# EAGLE schematic RMP - HALF BRIDGE 0.0.1 (EAGLE 9.6.2)

## Sheet 1 of 5
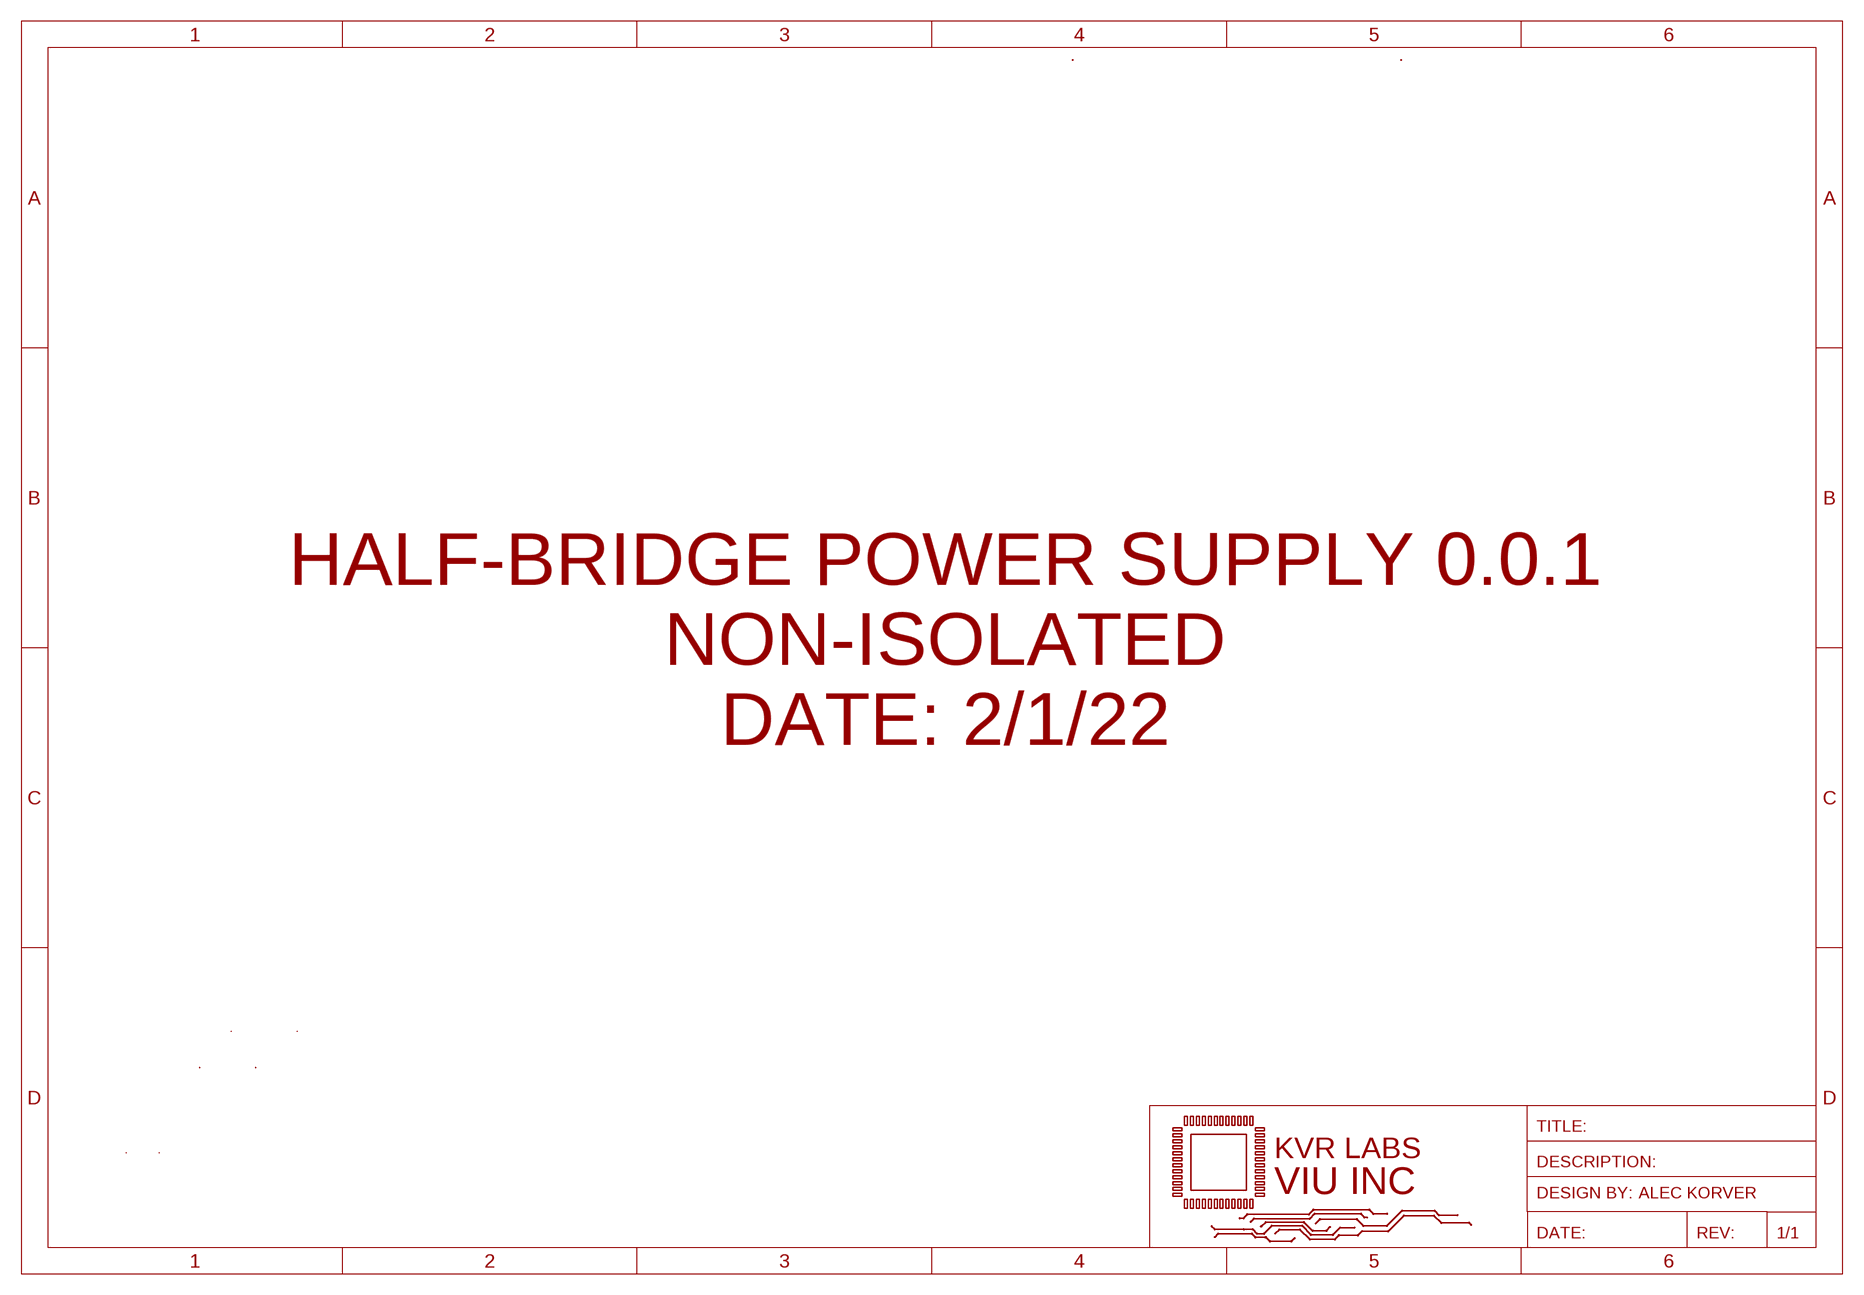
[diagram p0: schematic, sheet 1]

### Notes on the sheet
- HALF-BRIDGE POWER SUPPLY 0.0.1
  NON-ISOLATED
  DATE: 2/1/22

## Sheet 2 of 5: GATE DRIVERS
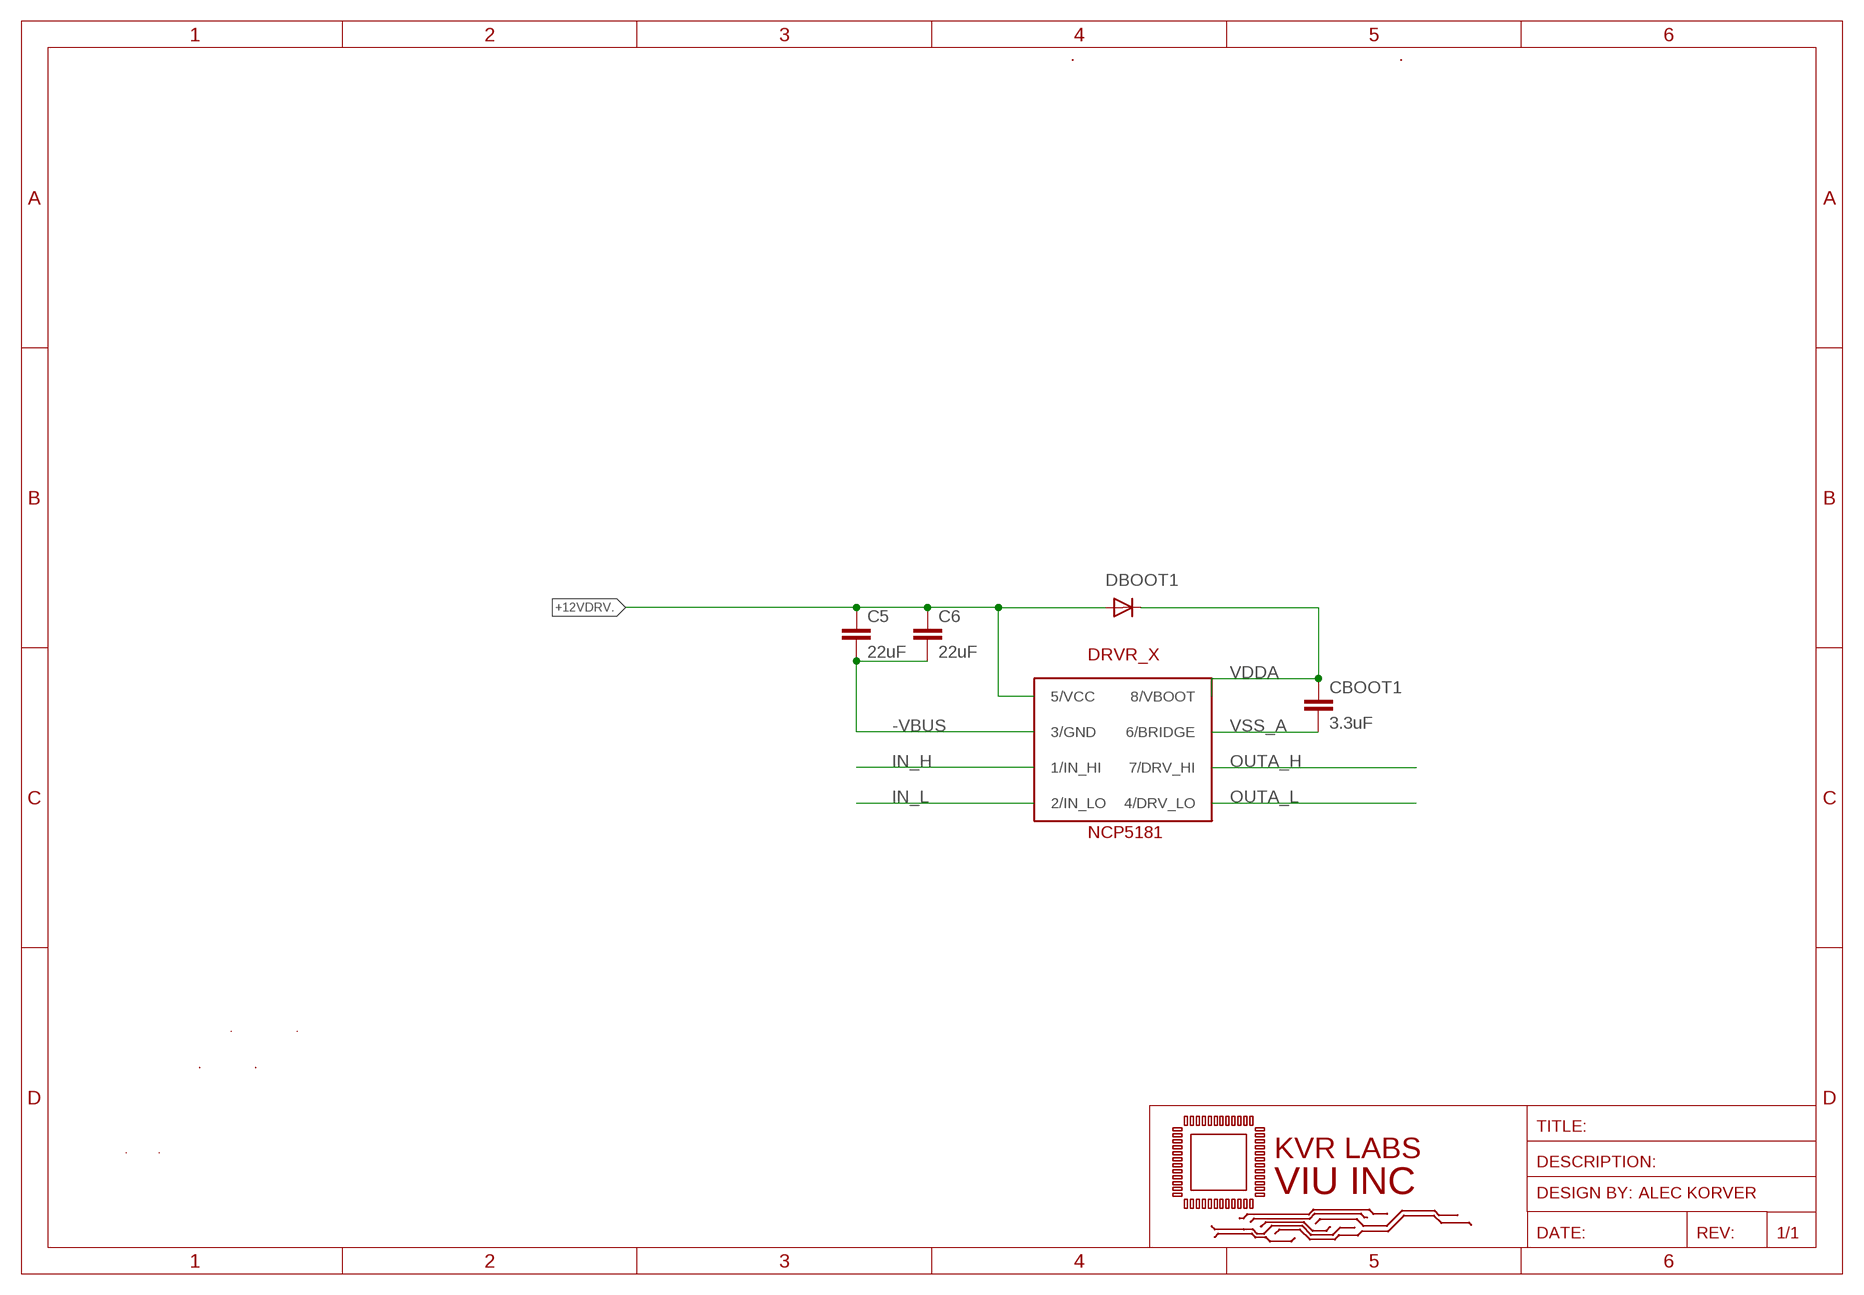
[diagram p1: schematic, sheet 2]

### Parts
C5  22uF  C-EUC1206  [C1206]
C6  22uF  C-EUC1206  [C1206]
CBOOT1  3.3uF  C-EUC1812  [C1812]
DBOOT1  DIODESMA  [SMADIODE]
DRVR_X  NCP5181  [8-SOIC]

### Nets
+12VDRV: C5.1 C6.1 DBOOT1.A DRVR_X.5(5/VCC) ; also sheet 4
-VBUS: C5.2 C6.2 DRVR_X.3(3/GND) ; also sheet 3,4,5
IN_H: DRVR_X.1(1/IN_HI) ; also sheet 4
IN_L: DRVR_X.2(2/IN_LO) ; also sheet 4
OUTA_H: DRVR_X.7(7/DRV_HI) ; also sheet 3
OUTA_L: DRVR_X.4(4/DRV_LO) ; also sheet 3
VDDA: CBOOT1.1 DBOOT1.C DRVR_X.8(8/VBOOT) ; also sheet 3,4,5
VSS_A: CBOOT1.2 DRVR_X.6(6/BRIDGE) ; also sheet 3,4

## Sheet 3 of 5: H BRIDGE - AC/DC STAGE
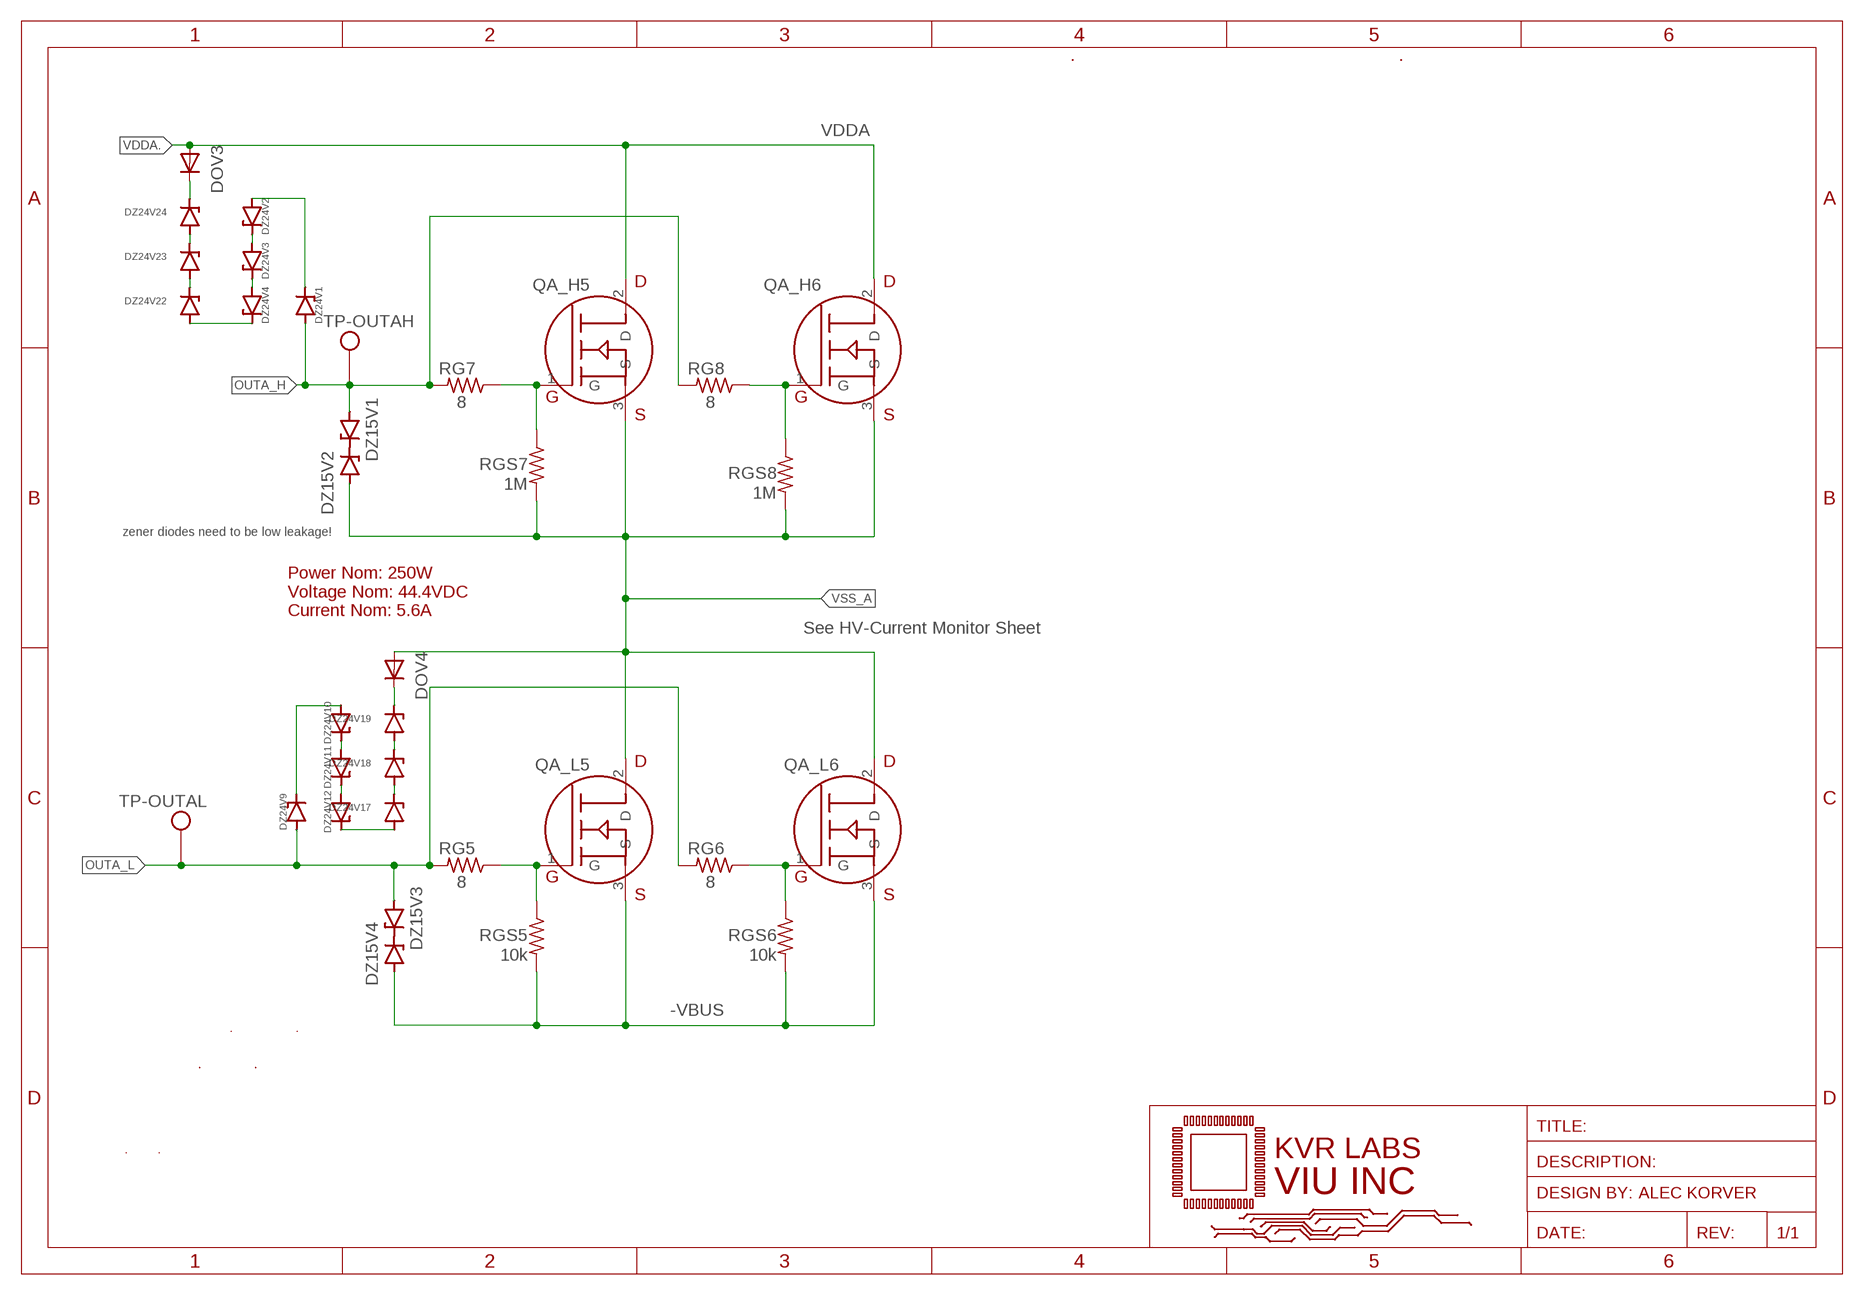
[diagram p2: schematic, sheet 3]

### Parts
DOV3  DIODESMA  [SMADIODE]
DOV4  DIODESMA  [SMADIODE]
DZ15V1  NZH15B,115  ZENER_MMSZ5240BTDO-219-AB(SOD123F)  [SODFL3718X115]
DZ15V2  NZH15B,115  ZENER_MMSZ5240BTDO-219-AB(SOD123F)  [SODFL3718X115]
DZ15V3  NZH15B,115  ZENER_MMSZ5240BTDO-219-AB(SOD123F)  [SODFL3718X115]
DZ15V4  NZH15B,115  ZENER_MMSZ5240BTDO-219-AB(SOD123F)  [SODFL3718X115]
DZ24V1  NZH15B,115  ZENER_MMSZ5240BTDO-219-AB(SOD123F)  [SODFL3718X115]
DZ24V2  NZH15B,115  ZENER_MMSZ5240BTDO-219-AB(SOD123F)  [SODFL3718X115]
DZ24V3  NZH15B,115  ZENER_MMSZ5240BTDO-219-AB(SOD123F)  [SODFL3718X115]
DZ24V4  NZH15B,115  ZENER_MMSZ5240BTDO-219-AB(SOD123F)  [SODFL3718X115]
DZ24V9  NZH15B,115  ZENER_MMSZ5240BTDO-219-AB(SOD123F)  [SODFL3718X115]
DZ24V10  NZH15B,115  ZENER_MMSZ5240BTDO-219-AB(SOD123F)  [SODFL3718X115]
DZ24V11  NZH15B,115  ZENER_MMSZ5240BTDO-219-AB(SOD123F)  [SODFL3718X115]
DZ24V12  NZH15B,115  ZENER_MMSZ5240BTDO-219-AB(SOD123F)  [SODFL3718X115]
DZ24V17  NZH15B,115  ZENER_MMSZ5240BTDO-219-AB(SOD123F)  [SODFL3718X115]
DZ24V18  NZH15B,115  ZENER_MMSZ5240BTDO-219-AB(SOD123F)  [SODFL3718X115]
DZ24V19  NZH15B,115  ZENER_MMSZ5240BTDO-219-AB(SOD123F)  [SODFL3718X115]
DZ24V22  NZH15B,115  ZENER_MMSZ5240BTDO-219-AB(SOD123F)  [SODFL3718X115]
DZ24V23  NZH15B,115  ZENER_MMSZ5240BTDO-219-AB(SOD123F)  [SODFL3718X115]
DZ24V24  NZH15B,115  ZENER_MMSZ5240BTDO-219-AB(SOD123F)  [SODFL3718X115]
QA_H5  IPB60R060P7ATMA1  [D2PACK]
QA_H6  IPB60R060P7ATMA1  [D2PACK]
QA_L5  IPB60R060P7ATMA1  [D2PACK]
QA_L6  IPB60R060P7ATMA1  [D2PACK]
RG5  8  R-US_R1206  [R1206]
RG6  8  R-US_R1206  [R1206]
RG7  8  R-US_R1206  [R1206]
RG8  8  R-US_R1206  [R1206]
RGS5  10k  R-US_R1206  [R1206]
RGS6  10k  R-US_R1206  [R1206]
RGS7  1M  R-US_R1206  [R1206]
RGS8  1M  R-US_R1206  [R1206]
TP-OUTAH  THM_TESTPOINT_5000_SERIES  [THM-TESTPOINT]
TP-OUTAL  THM_TESTPOINT_5000_SERIES  [THM-TESTPOINT]

### Nets
-VBUS: DZ15V4.2(A) QA_L5.3(S) QA_L6.3(S) RGS5.2 RGS6.2 ; also sheet 2,4,5
N$1: DZ24V2.1(C) DZ24V3.2(A)
N$2: DZ24V3.1(C) DZ24V4.2(A)
N$3: DZ24V1.1(C) DZ24V2.2(A)
N$4: DZ24V4.1(C) DZ24V22.2(A)
N$5: DZ24V12.1(C) DZ24V17.2(A)
N$25: DZ24V10.1(C) DZ24V11.2(A)
N$26: DZ24V11.1(C) DZ24V12.2(A)
N$31: DZ15V3.1(C) DZ15V4.1(C)
N$33: DZ24V9.1(C) DZ24V10.2(A)
N$34: DZ24V17.1(C) DZ24V18.2(A)
N$35: DZ24V18.1(C) DZ24V19.2(A)
N$36: DOV4.C DZ24V19.1(C)
N$38: DZ15V1.1(C) DZ15V2.1(C)
N$40: DZ24V22.1(C) DZ24V23.2(A)
N$42: DZ24V23.1(C) DZ24V24.2(A)
N$43: QA_L6.1(G) RG6.1 RGS6.1
N$44: QA_H6.1(G) RG8.1 RGS8.1
N$45: QA_H5.1(G) RG7.1 RGS7.1
N$46: QA_L5.1(G) RG5.1 RGS5.1
N$47: DOV3.C DZ24V24.1(C)
OUTA_H: DZ15V1.2(A) DZ24V1.2(A) RG7.2 RG8.2 TP-OUTAH.P1 ; also sheet 2
OUTA_L: DZ15V3.2(A) DZ24V9.2(A) RG5.2 RG6.2 TP-OUTAL.P1 ; also sheet 2
VDDA: DOV3.A QA_H5.2(D) QA_H6.2(D) ; also sheet 2,4,5
VSS_A: DOV4.A DZ15V2.2(A) QA_H5.3(S) QA_H6.3(S) QA_L5.2(D) QA_L6.2(D) RGS7.2 RGS8.2 ; also sheet 2,4

### Notes on the sheet
- zener diodes need to be low leakage!
- Power Nom: 250W
  Voltage Nom: 44.4VDC
  Current Nom: 5.6A
- See HV-Current Monitor Sheet

## Sheet 4 of 5: CONNECTORS
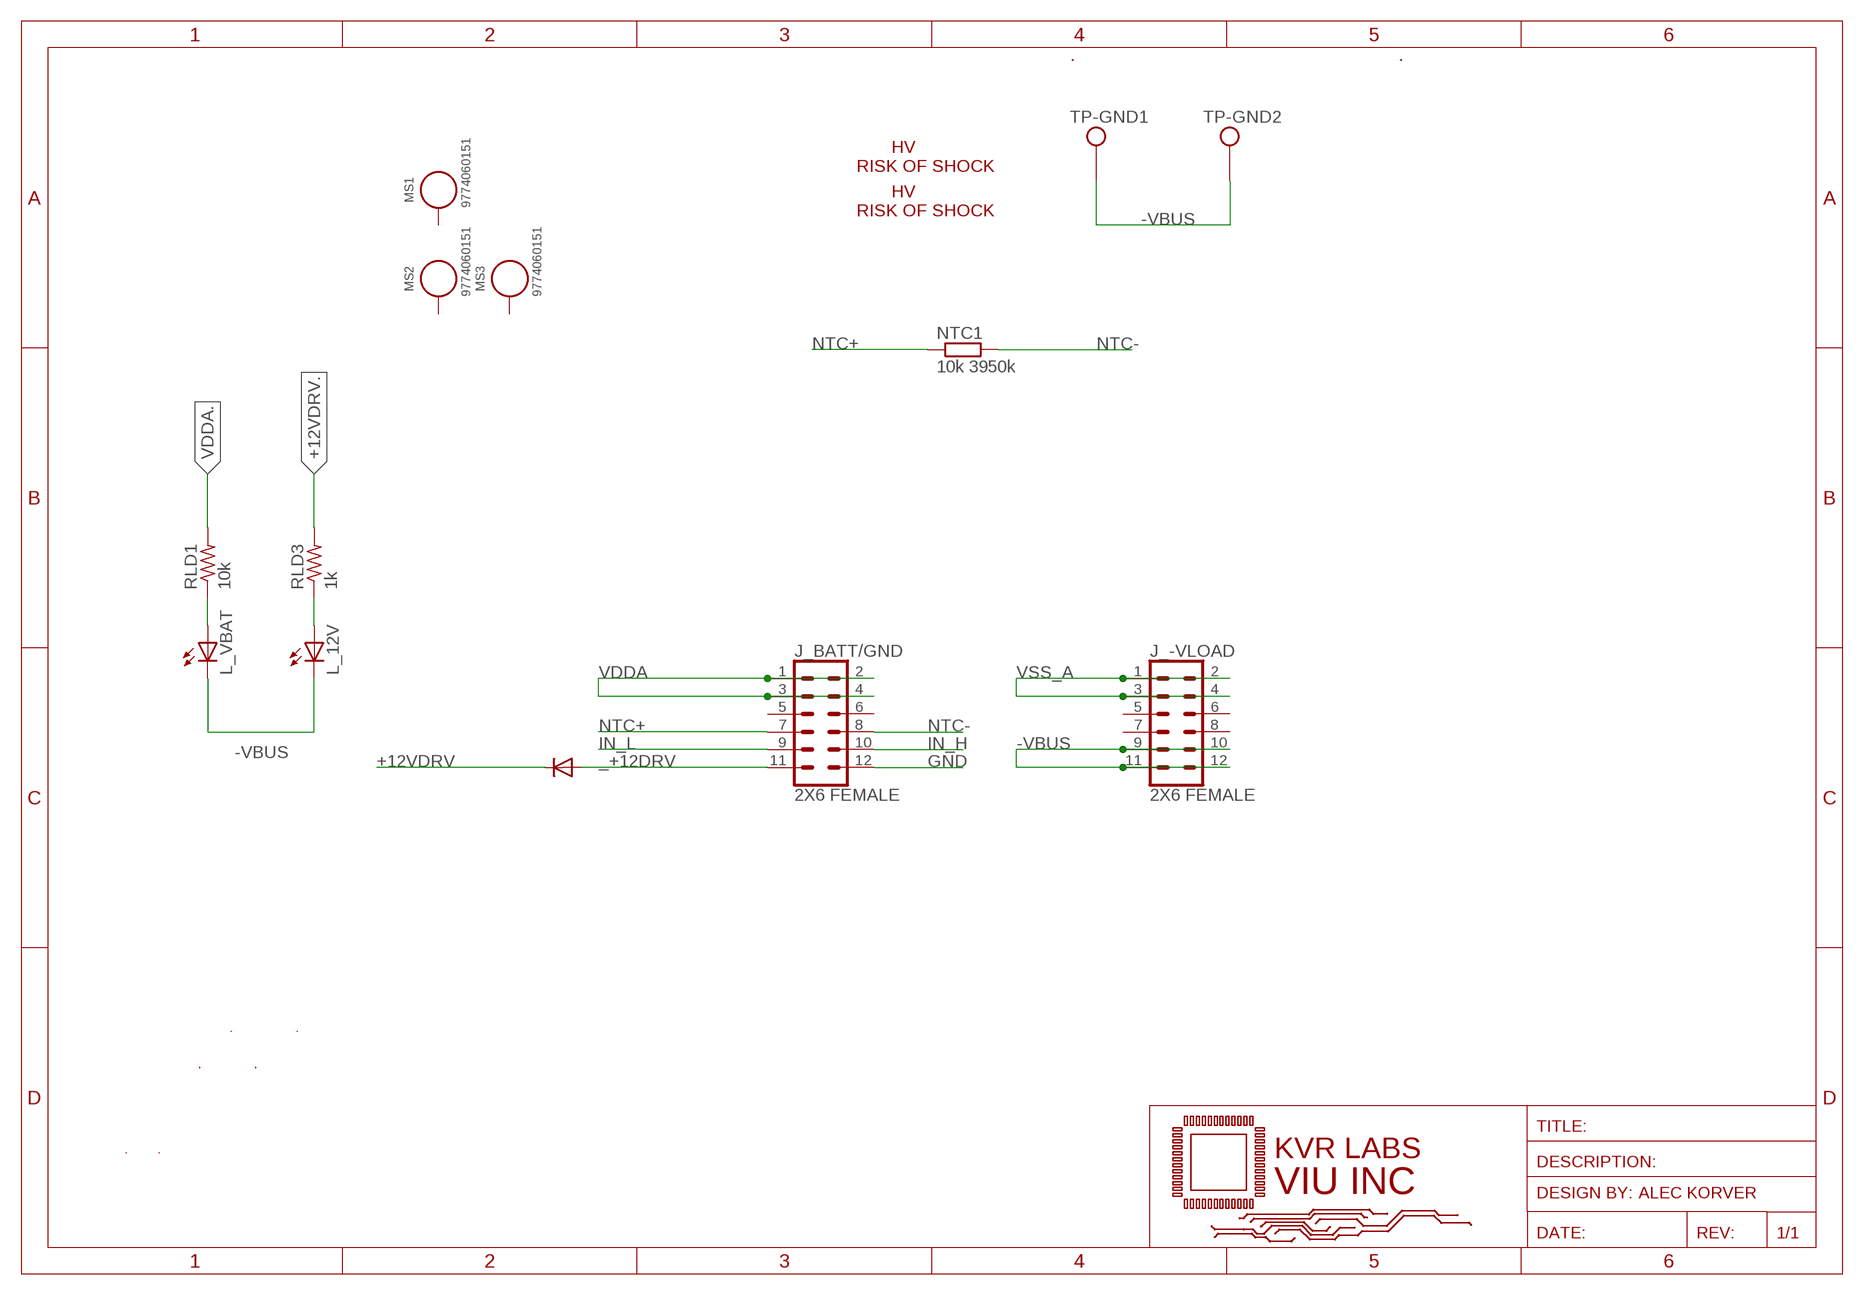
[diagram p3: schematic, sheet 4]

### Parts
D12IN  DIODESMA  [SMADIODE]
J_-VLOAD  2X6 FEMALE  CONN_06X2PTH_FEMALE  [2X6]
J_BATT/GND  2X6 FEMALE  CONN_06X2PTH_FEMALE  [2X6]
L_12V  LEDCHIPLED_1206  [CHIPLED_1206]
L_VBAT  LEDCHIPLED_1206  [CHIPLED_1206]
MS1  9774060151  WA-SMSI_9774XXX151_9774060151  [WA-SMSI_9774060151]
MS2  9774060151  WA-SMSI_9774XXX151_9774060151  [WA-SMSI_9774060151]
MS3  9774060151  WA-SMSI_9774XXX151_9774060151  [WA-SMSI_9774060151]
NTC1  10k 3950k  R-EU_R0805  [R0805]
RLD1  10k  R-US_R1206  [R1206]
RLD3  1k  R-US_R1206  [R1206]
TP-GND1  THM_TESTPOINT_5000_SERIES  [THM-TESTPOINT]
TP-GND2  THM_TESTPOINT_5000_SERIES  [THM-TESTPOINT]
U$10  ELECTRIC_SHOCK  [ELECTRIC_SHOCK]
U$11  ELECTRIC_SHOCK  [ELECTRIC_SHOCK]

### Nets
+12VDRV: D12IN.C RLD3.2 ; also sheet 2
-VBUS: J_-VLOAD.9 J_-VLOAD.10 J_-VLOAD.11 J_-VLOAD.12 L_12V.C L_VBAT.C TP-GND1.P1 TP-GND2.P1 ; also sheet 2,3,5
_+12DRV: D12IN.A J_BATT/GND.11
GND: J_BATT/GND.12
IN_H: J_BATT/GND.10 ; also sheet 2
IN_L: J_BATT/GND.9 ; also sheet 2
N$17: L_VBAT.A RLD1.1
N$20: L_12V.A RLD3.1
NTC+: J_BATT/GND.7 NTC1.1
NTC-: J_BATT/GND.8 NTC1.2
VDDA: J_BATT/GND.1 J_BATT/GND.2 J_BATT/GND.3 J_BATT/GND.4 RLD1.2 ; also sheet 2,3,5
VSS_A: J_-VLOAD.1 J_-VLOAD.2 J_-VLOAD.3 J_-VLOAD.4 ; also sheet 2,3
Unconnected: J_-VLOAD.5 J_-VLOAD.6 J_-VLOAD.7 J_-VLOAD.8 J_BATT/GND.5 J_BATT/GND.6 MS1.1 MS2.1 MS3.1

## Sheet 5 of 5: CERAMIC DC LINK CAPACITANCE
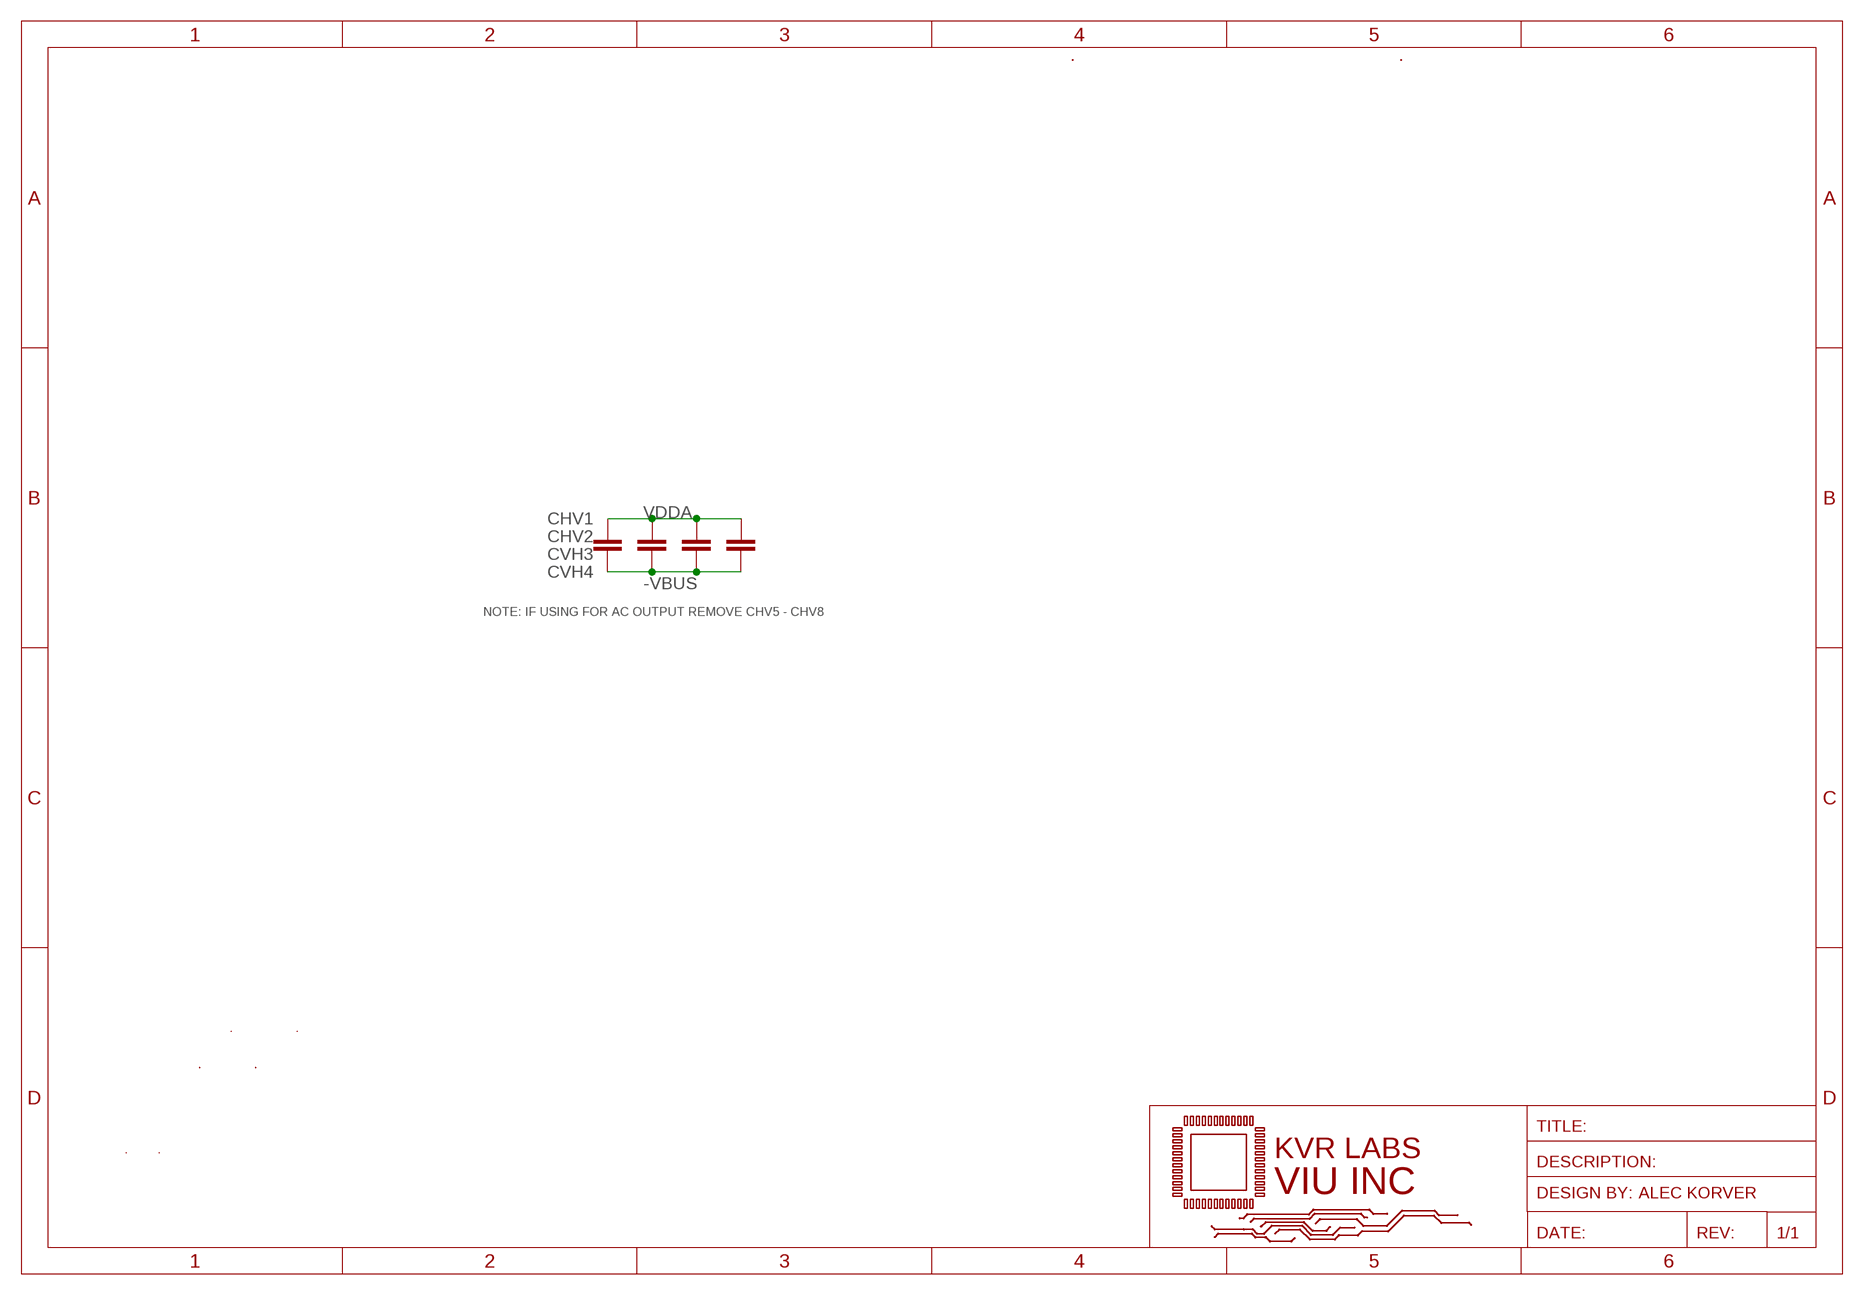
[diagram p4: schematic, sheet 5]

### Parts
CHV1  3.3uF, 100V  C-EUC2220K  [C2220K]
CHV2  3.3uF, 100V  C-EUC2220K  [C2220K]
CVH3  3.3uF, 100V  C-EUC2220K  [C2220K]
CVH4  3.3uF, 100V  C-EUC2220K  [C2220K]

### Nets
-VBUS: CHV1.2 CHV2.2 CVH3.2 CVH4.2 ; also sheet 2,3,4
VDDA: CHV1.1 CHV2.1 CVH3.1 CVH4.1 ; also sheet 2,3,4

### Notes on the sheet
- NOTE: IF USING FOR AC OUTPUT REMOVE CHV5 - CHV8

## Library data of the parts
C5 C6 = rcl:C-EU: CAPACITOR, European symbol; LCSC_PART: C77091; SPICEPREFIX: C
CBOOT1 = rcl:C-EU: CAPACITOR, European symbol; LCSC_PART: C342636; SPICEPREFIX: C
CHV1 CHV2 CVH3 CVH4 = rcl:C-EU: CAPACITOR, European symbol; LCSC_PART: C342270; SPICEPREFIX: C
D12IN DOV3 DOV4 = adafruit:DIODE: Diode SMADIODE - SMA Surface Mount Package 20V 1A Schottky Diode Digikey: 641-1014-6-ND DO-1N4148 - Through Hole Small Current Diode SOD-123 20V 1 A (.5mV Vf) Schottky Diode - Digikey: MBRX120TPMSCT-ND SOD-323 10V 570mA (.38mV Vf, 3ns) Schottky Diode - Digikey: ZLLS410CT-ND SOD-523 30V 30mA Schottky Diode (RB751S-40TE61) - Digikey: RB751S-40TE61CT-ND SOT23-R/W - SOT23 Package (R = Solder Paste/Reflow Ovens, W = Hand-Soldering) BAT54Film 40V 300mA - Digikey: 497-7162-1-ND; I_AVG: 1A; LCSC_PART: C110531; VF: 1.3V; VR: 400V
DBOOT1 = adafruit:DIODE: Diode SMADIODE - SMA Surface Mount Package 20V 1A Schottky Diode Digikey: 641-1014-6-ND DO-1N4148 - Through Hole Small Current Diode SOD-123 20V 1 A (.5mV Vf) Schottky Diode - Digikey: MBRX120TPMSCT-ND SOD-323 10V 570mA (.38mV Vf, 3ns) Schottky Diode - Digikey: ZLLS410CT-ND SOD-523 30V 30mA Schottky Diode (RB751S-40TE61) - Digikey: RB751S-40TE61CT-ND SOT23-R/W - SOT23 Package (R = Solder Paste/Reflow Ovens, W = Hand-Soldering) BAT54Film 40V 300mA - Digikey: 497-7162-1-ND; LCSC_PART: C110531
DRVR_X = KVRLABS-Gatedrivers:NCP5181; LCSC_PART: DNP
DZ15V1-DZ15V4 = Diode:ZENER_: Zener Diode - Popular parts; CATEGORY: Diode; DESCRIPTION: DIODE ZENER 10V 500MW SOD123; LCSC_PART: C173428; MANUFACTURER: ON Semiconductor; MPN: MMSZ5240BT1G; SUB-CATEGORY: Zener; THERMALLOSS: 0.5W; VALUE: MMSZ5240BT1G
DZ24V1-DZ24V4 DZ24V9-DZ24V12 DZ24V17-DZ24V19 DZ24V22-DZ24V24 = Diode:ZENER_: Zener Diode - Popular parts; CATEGORY: Diode; DESCRIPTION: DIODE ZENER 10V 500MW SOD123; LCSC_PART: C266572; MANUFACTURER: ON Semiconductor; MODEL: BZT52C24; MPN: MMSZ5240BT1G; SUB-CATEGORY: Zener; THERMALLOSS: 0.5W; VALUE: MMSZ5240BT1G
J_-VLOAD J_BATT/GND = SparkFun-Connectors:CONN_06X2: Multi connection point. Often used as Generic Header-pin footprint for 0.1 inch spaced/style header connections On any of the 0.1 inch spaced packages, you can populate with these: Break Away Headers - Straight <https://www.sparkfun.com/products/116> (PRT-00116) Break Away Male Headers - Right Angle <https://www.sparkfun.com/products/553> (PRT-00553) Female Headers <https://www.sparkfun.com/products/115> (PRT-00115) Break Away Headers - Machine Pin <https://www.sparkfun.com/products/117> (PRT-00117) Break Away Female Headers - Swiss Machine Pin <https://www.sparkfun.com/products/743> (PRT-00743); LCSC_PART: DNP; MODEL: TSW-106-05-G-D; PROD_ID: CONN-12423
L_12V L_VBAT = adafruit:LED: LED OSRAM: - CHIPLED LG R971, LG N971, LY N971, LG Q971, LY Q971, LO R971, LY R971 LH N974, LH R974 LS Q976, LO Q976, LY Q976 LO Q996 - Hyper CHIPLED LW Q18S LB Q993, LB Q99A, LB R99A - SideLED LS A670, LO A670, LY A670, LG A670, LP A670 LB A673, LV A673, LT A673, LW A673 LH A674 LY A675 LS A676, LA A676, LO A676, LY A676, LW A676 LS A679, LY A679, LG A679 - Hyper Micro SIDELED® LS Y876, LA Y876, LO Y876, LY Y876 LT Y87S - SmartLED LW L88C, LW L88S LB L89C, LB L89S, LG L890 LS L89K, LO L89K, LY L89K LS L896, LA L896, LO L896, LY L896 - TOPLED LS T670, LO T670, LY T670, LG T670, LP T670 LSG T670, LSP T670, LSY T670, LOP T670, LYG T670 LG T671, LOG T671, LSG T671 LB T673, LV T673, LT T673, LW T673 LH T674 LS T676, LA T676, LO T676, LY T676, LB T676, LH T676, LSB T676, LW T676 LB T67C, LV T67C, LT T67C, LS T67K, LO T67K, LY T67K, LW E67C LS E67B, LA E67B, LO E67B, LY E67B, LB E67C, LV E67C, LT E67C LW T67C LS T679, LY T679, LG T679 LS T770, LO T770, LY T770, LG T770, LP T770 LB T773, LV T773, LT T773, LW T773 LH T774 LS E675, LA E675, LY E675, LS T675 LS T776, LA T776, LO T776, LY T776, LB T776 LHGB T686 LT T68C, LB T68C - Hyper Mini TOPLED® LB M676 - Mini TOPLED Santana® LG M470 LS M47K, LO M47K, LY M47K Source: http://www.osram.convergy.de/; LCSC_PART: C434439
MS1-MS3 = Eagle_WA-SMSI (rev20d) (1):WA-SMSI_9774XXX151: WA-SMSI SMT Steel Spacer, M2.5 Thread Internal PROPERTIES Material Steel Surface Tin GENERAL INFORMATION Operating Temperature -55 up to +150 °C PACKAGING PROPERTIES Packaging Bag;​ Tape and Reel;​ Bulk Packaging Unit 450 <https://katalog.we-online.de/media/images/v2/o92910v209%20Family_WA-SMSI_M2-M2.5.jpg> Details see: https://katalog.we-online.de/en/em/SMSI_SMT_STEEL_SPACER_M2_5_THREAD_INTERNAL Updated by Ella Wu 2020-05-18 2020(C) Wurth Elektronik; DATASHEET-URL: https://www.we-online.de/katalog/datasheet/9774060151.pdf; INNER-DIAMETER: 3.5mm; INNER-THREAD-LENGTH: -; LCSC_PART: DNP; OUTER-DIAMETER: 5.1mm; PART-NUMBER: 9774060151; PIN-LENGTH: 6mm; THREAD: M2.5
NTC1 = rcl:R-EU_: RESISTOR, European symbol; BETA: 3950K; LCSC_PART: C95968; RESISTANCE: 10k; SPICEPREFIX: R
QA_H5 QA_H6 QA_L5 QA_L6 = PSFBC:IPB60R060P7ATMA1: IPB60R060P7ATMA1 VDS: 650V Id: 48A(Tc) Rdson: 60mOhm Vgsth: 4V https://www.digikey.com/product-detail/en/infineon-technologies/IPB60R060P7ATMA1/IPB60R060P7ATMA1CT-ND/8259678; CISS: 4050pF; COSS: 1480pF; CRSS: 58pF; LCSC_PART: DNP; MODEL: SQM10250E_GE3; QGC: 75nC; RDSON: 30mOhm; TDELAY: 60ns; TFALL: 20ns; TRISE: 30ns; VDS: 250V; VGSMAX: +/- 20V; VGSTH: 3.5V
RG5-RG8 = rcl:R-US_: RESISTOR, American symbol; LCSC_PART: C118070; SPICEPREFIX: R
RGS5 RGS6 RLD1 = rcl:R-US_: RESISTOR, American symbol; LCSC_PART: C140407; SPICEPREFIX: R
RGS7 RGS8 = rcl:R-US_: RESISTOR, American symbol; LCSC_PART: C105578; SPICEPREFIX: R
RLD3 = rcl:R-US_: RESISTOR, American symbol; LCSC_PART: C115421; SPICEPREFIX: R
TP-GND1 TP-GND2 TP-OUTAH TP-OUTAL = PSFBC:THM_TESTPOINT_5000_SERIES; LCSC_PART: DNP
U$10 U$11 = PSFBC:ELECTRIC_SHOCK; LCSC_PART: DNP

## Net classes
0 default: width 0.089 mm, drill 0.2 mm, clearance 0.089 mm